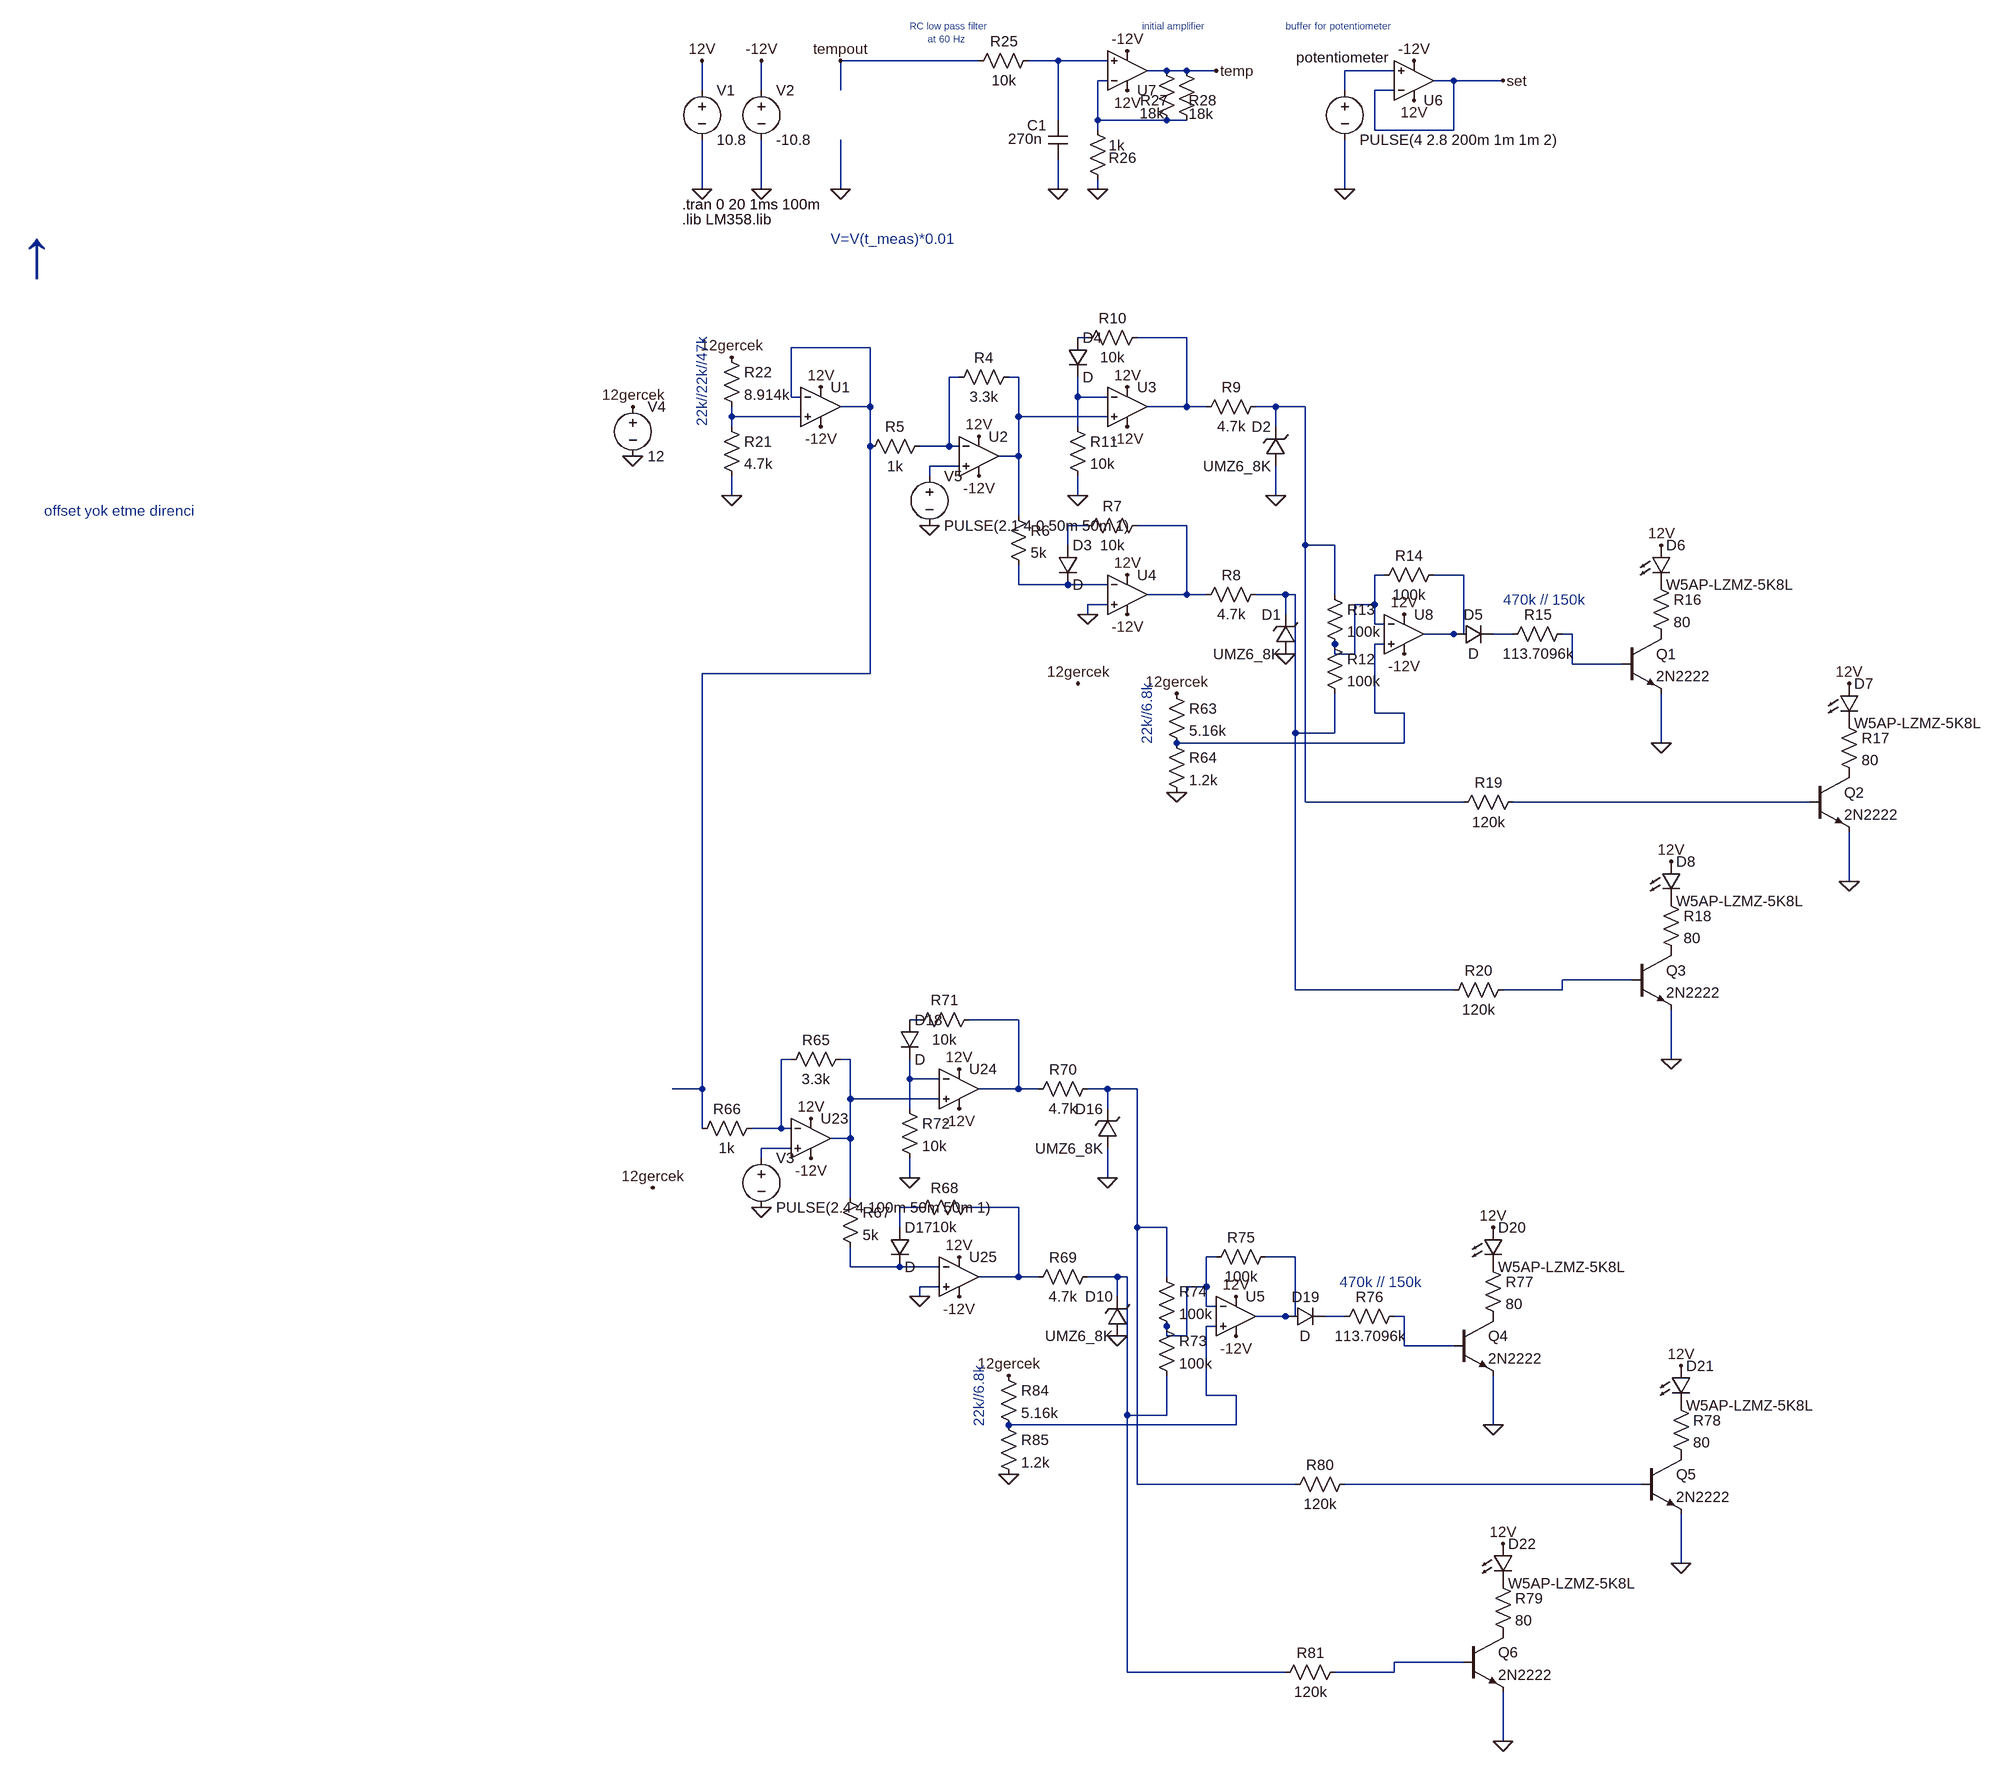
[diagram p0: schematic TRANSFORMERS-ASSEMBLE-7update.asc]
TRANSFORMERS-ASSEMBLE-7update.asc, the LTspice schematic file:
Version 4
SHEET 1 5384 2724
WIRE -912 -16 -1136 -16
WIRE -784 -16 -832 -16
WIRE -704 -16 -784 -16
WIRE -608 0 -640 0
WIRE -576 0 -608 0
WIRE -528 0 -576 0
WIRE -240 0 -320 0
WIRE -704 16 -720 16
WIRE -144 16 -176 16
WIRE -64 16 -144 16
WIRE -1360 32 -1360 -16
WIRE -1264 32 -1264 -16
WIRE -1136 32 -1136 -16
WIRE -320 32 -320 0
WIRE -240 32 -272 32
WIRE -784 80 -784 -16
WIRE -720 80 -720 16
WIRE -608 80 -720 80
WIRE -576 80 -608 80
WIRE -720 96 -720 80
WIRE -272 96 -272 32
WIRE -144 96 -144 16
WIRE -144 96 -272 96
WIRE -1360 192 -1360 112
WIRE -1264 192 -1264 112
WIRE -1136 192 -1136 112
WIRE -784 192 -784 144
WIRE -720 192 -720 176
WIRE -320 192 -320 112
WIRE -736 432 -752 432
WIRE -576 432 -656 432
WIRE -1088 448 -1216 448
WIRE -944 496 -960 496
WIRE -848 496 -864 496
WIRE -1216 528 -1216 448
WIRE -1200 528 -1216 528
WIRE -752 528 -752 496
WIRE -704 528 -752 528
WIRE -1088 544 -1088 448
WIRE -1088 544 -1136 544
WIRE -576 544 -576 432
WIRE -576 544 -640 544
WIRE -544 544 -576 544
WIRE -432 544 -464 544
WIRE -384 544 -432 544
WIRE -1312 560 -1312 544
WIRE -1200 560 -1312 560
WIRE -848 560 -848 496
WIRE -704 560 -848 560
WIRE -1312 576 -1312 560
WIRE -752 576 -752 528
WIRE -432 576 -432 544
WIRE -1088 608 -1088 544
WIRE -960 608 -960 496
WIRE -960 608 -1008 608
WIRE -944 608 -960 608
WIRE -848 624 -848 560
WIRE -848 624 -880 624
WIRE -944 640 -992 640
WIRE -992 656 -992 640
WIRE -1312 688 -1312 656
WIRE -752 688 -752 656
WIRE -432 688 -432 640
WIRE -848 720 -848 624
WIRE -736 736 -768 736
WIRE -576 736 -656 736
WIRE -768 768 -768 736
WIRE -384 768 -384 544
WIRE -336 768 -384 768
WIRE -256 816 -272 816
WIRE -128 816 -176 816
WIRE -848 832 -848 800
WIRE -768 832 -848 832
WIRE -704 832 -768 832
WIRE -576 848 -576 736
WIRE -576 848 -640 848
WIRE -544 848 -576 848
WIRE -416 848 -464 848
WIRE -400 848 -416 848
WIRE -336 848 -336 768
WIRE -704 864 -736 864
WIRE -272 864 -272 816
WIRE -272 864 -304 864
WIRE -736 880 -736 864
WIRE -416 880 -416 848
WIRE -272 896 -272 864
WIRE -256 896 -272 896
WIRE -144 912 -192 912
WIRE -128 912 -128 816
WIRE -128 912 -144 912
WIRE -48 912 -80 912
WIRE 48 912 32 912
WIRE -256 928 -272 928
WIRE -336 944 -336 928
WIRE -304 944 -304 864
WIRE -304 944 -336 944
WIRE 48 960 48 912
WIRE 128 960 48 960
WIRE -1088 976 -1088 608
WIRE -1088 976 -1360 976
WIRE -272 1040 -272 928
WIRE -224 1040 -272 1040
WIRE -400 1072 -400 848
WIRE -336 1072 -336 1008
WIRE -336 1072 -400 1072
WIRE -224 1088 -224 1040
WIRE -224 1088 -592 1088
WIRE 192 1088 192 1008
WIRE -384 1184 -384 768
WIRE -128 1184 -384 1184
WIRE 432 1184 -48 1184
WIRE 496 1312 496 1232
WIRE 144 1472 32 1472
WIRE -400 1488 -400 1072
WIRE -144 1488 -400 1488
WIRE 32 1488 32 1472
WIRE 32 1488 -64 1488
WIRE -1008 1536 -1024 1536
WIRE -848 1536 -928 1536
WIRE -1216 1600 -1232 1600
WIRE -1120 1600 -1136 1600
WIRE 208 1600 208 1520
WIRE -1024 1632 -1024 1600
WIRE -976 1632 -1024 1632
WIRE -1360 1648 -1360 976
WIRE -1360 1648 -1408 1648
WIRE -848 1648 -848 1536
WIRE -848 1648 -912 1648
WIRE -816 1648 -848 1648
WIRE -704 1648 -736 1648
WIRE -656 1648 -704 1648
WIRE -1120 1664 -1120 1600
WIRE -976 1664 -1120 1664
WIRE -1024 1680 -1024 1632
WIRE -704 1680 -704 1648
WIRE -1360 1712 -1360 1648
WIRE -1232 1712 -1232 1600
WIRE -1232 1712 -1280 1712
WIRE -1216 1712 -1232 1712
WIRE -1120 1728 -1120 1664
WIRE -1120 1728 -1152 1728
WIRE -1216 1744 -1264 1744
WIRE -1264 1760 -1264 1744
WIRE -1024 1792 -1024 1760
WIRE -704 1792 -704 1744
WIRE -1120 1824 -1120 1728
WIRE -1008 1840 -1040 1840
WIRE -848 1840 -928 1840
WIRE -1040 1872 -1040 1840
WIRE -656 1872 -656 1648
WIRE -608 1872 -656 1872
WIRE -528 1920 -544 1920
WIRE -400 1920 -448 1920
WIRE -1120 1936 -1120 1904
WIRE -1040 1936 -1120 1936
WIRE -976 1936 -1040 1936
WIRE -848 1952 -848 1840
WIRE -848 1952 -912 1952
WIRE -816 1952 -848 1952
WIRE -688 1952 -736 1952
WIRE -672 1952 -688 1952
WIRE -608 1952 -608 1872
WIRE -976 1968 -1008 1968
WIRE -544 1968 -544 1920
WIRE -544 1968 -576 1968
WIRE -1008 1984 -1008 1968
WIRE -688 1984 -688 1952
WIRE -544 2000 -544 1968
WIRE -528 2000 -544 2000
WIRE -416 2016 -464 2016
WIRE -400 2016 -400 1920
WIRE -400 2016 -416 2016
WIRE -320 2016 -352 2016
WIRE -224 2016 -240 2016
WIRE -528 2032 -544 2032
WIRE -608 2048 -608 2032
WIRE -576 2048 -576 1968
WIRE -576 2048 -608 2048
WIRE -224 2064 -224 2016
WIRE -144 2064 -224 2064
WIRE -544 2144 -544 2032
WIRE -496 2144 -544 2144
WIRE -672 2176 -672 1952
WIRE -608 2176 -608 2112
WIRE -608 2176 -672 2176
WIRE -496 2192 -496 2144
WIRE -496 2192 -864 2192
WIRE -80 2192 -80 2112
WIRE -656 2288 -656 1872
WIRE -400 2288 -656 2288
WIRE 160 2288 -320 2288
WIRE 224 2416 224 2336
WIRE -128 2576 -240 2576
WIRE -672 2592 -672 2176
WIRE -416 2592 -672 2592
WIRE -240 2592 -240 2576
WIRE -240 2592 -336 2592
WIRE -64 2704 -64 2624
FLAG -1360 192 0
FLAG -1360 -16 12V
FLAG -1264 192 0
FLAG -1264 -16 -12V
FLAG -1136 192 0
FLAG -672 -32 -12V
FLAG -672 32 12V
FLAG -784 192 0
FLAG -720 192 0
FLAG -528 0 temp
FLAG -320 192 0
FLAG -208 -16 -12V
FLAG -208 48 12V
FLAG -64 16 set
FLAG -912 656 -12V
FLAG -912 592 12V
FLAG -1312 688 0
FLAG -736 880 0
FLAG -672 880 -12V
FLAG -672 816 12V
FLAG -416 944 0
FLAG -432 688 0
FLAG -672 576 -12V
FLAG -672 512 12V
FLAG -752 688 0
FLAG -224 944 -12V
FLAG -224 880 12V
FLAG 192 1088 0
FLAG 192 768 12V
FLAG 496 1312 0
FLAG 496 992 12V
FLAG 208 1600 0
FLAG 208 1280 12V
FLAG -1168 576 -12V
FLAG -1168 512 12V
FLAG -1136 -16 tempout
FLAG -992 736 0
FLAG -592 1168 0
FLAG -1184 1760 -12V
FLAG -1184 1696 12V
FLAG -1008 1984 0
FLAG -944 1984 -12V
FLAG -944 1920 12V
FLAG -688 2048 0
FLAG -704 1792 0
FLAG -944 1680 -12V
FLAG -944 1616 12V
FLAG -1024 1792 0
FLAG -496 2048 -12V
FLAG -496 1984 12V
FLAG -80 2192 0
FLAG -80 1872 12V
FLAG 224 2416 0
FLAG 224 2096 12V
FLAG -64 2704 0
FLAG -64 2384 12V
FLAG -864 2272 0
FLAG -1264 1840 0
FLAG -1472 624 0
FLAG -1472 544 12gercek
FLAG -1312 464 12gercek
FLAG -752 992 12gercek
FLAG -592 1008 12gercek
FLAG -1440 1808 12gercek
FLAG -864 2112 12gercek
SYMBOL voltage -1360 16 R0
WINDOW 123 0 0 Left 0
WINDOW 39 0 0 Left 0
SYMATTR InstName V1
SYMATTR Value 10.8
SYMBOL voltage -1264 16 R0
WINDOW 123 0 0 Left 0
WINDOW 39 0 0 Left 0
SYMATTR InstName V2
SYMATTR Value -10.8
SYMBOL res -816 -32 R90
WINDOW 0 0 56 VBottom 2
WINDOW 3 32 56 VTop 2
SYMATTR InstName R25
SYMATTR Value 10k
SYMBOL cap -800 80 R0
WINDOW 0 -34 8 Left 2
WINDOW 3 -65 30 Left 2
SYMATTR InstName C1
SYMATTR Value 270n
SYMBOL res -736 80 R0
WINDOW 0 34 61 Left 2
WINDOW 3 34 41 Left 2
SYMATTR InstName R26
SYMATTR Value 1k
SYMBOL res -624 -16 R0
WINDOW 0 -27 64 Left 2
WINDOW 3 -28 85 Left 2
SYMATTR InstName R27
SYMATTR Value 18k
SYMBOL res -592 -16 R0
WINDOW 0 19 64 Left 2
WINDOW 3 19 86 Left 2
SYMATTR InstName R28
SYMATTR Value 18k
SYMBOL voltage -320 16 R0
WINDOW 0 -79 -38 Left 2
WINDOW 123 0 0 Left 0
WINDOW 39 0 0 Left 0
SYMATTR InstName potentiometer
SYMATTR Value PULSE(4 2.8 200m 1m 1m 2)
SYMBOL res -848 480 R90
WINDOW 0 0 56 VBottom 2
WINDOW 3 32 56 VTop 2
SYMATTR InstName R4
SYMATTR Value 3.3k
SYMBOL res -992 592 R90
WINDOW 0 0 56 VBottom 2
WINDOW 3 32 56 VTop 2
SYMATTR InstName R5
SYMATTR Value 1k
SYMBOL res -864 704 R0
SYMATTR InstName R6
SYMATTR Value 5k
SYMBOL res -640 720 R90
WINDOW 0 0 56 VBottom 2
WINDOW 3 32 56 VTop 2
SYMATTR InstName R7
SYMATTR Value 10k
SYMBOL zener -400 944 R180
WINDOW 0 24 64 Left 2
WINDOW 3 24 0 Left 2
SYMATTR InstName D1
SYMATTR Value UMZ6_8K
SYMBOL res -448 832 R90
WINDOW 0 0 56 VBottom 2
WINDOW 3 32 56 VTop 2
SYMATTR InstName R8
SYMATTR Value 4.7k
SYMBOL zener -416 640 R180
WINDOW 0 24 64 Left 2
WINDOW 3 24 0 Left 2
SYMATTR InstName D2
SYMATTR Value UMZ6_8K
SYMBOL res -448 528 R90
WINDOW 0 0 56 VBottom 2
WINDOW 3 32 56 VTop 2
SYMATTR InstName R9
SYMATTR Value 4.7k
SYMBOL res -640 416 R90
WINDOW 0 0 56 VBottom 2
WINDOW 3 32 56 VTop 2
SYMATTR InstName R10
SYMATTR Value 10k
SYMBOL res -768 560 R0
SYMATTR InstName R11
SYMATTR Value 10k
SYMBOL diode -784 768 R0
SYMATTR InstName D3
SYMBOL diode -768 432 R0
SYMATTR InstName D4
SYMBOL res -352 912 R0
SYMATTR InstName R12
SYMATTR Value 100k
SYMBOL res -352 832 R0
SYMATTR InstName R13
SYMATTR Value 100k
SYMBOL res -160 800 R90
WINDOW 0 0 56 VBottom 2
WINDOW 3 32 56 VTop 2
SYMATTR InstName R14
SYMATTR Value 100k
SYMBOL diode -144 928 R270
WINDOW 0 32 32 VTop 2
WINDOW 3 0 32 VBottom 2
SYMATTR InstName D5
SYMBOL npn 128 912 R0
SYMATTR InstName Q1
SYMATTR Value 2N2222
SYMBOL res 48 896 R90
WINDOW 0 0 56 VBottom 2
WINDOW 3 32 56 VTop 2
SYMATTR InstName R15
SYMATTR Value 113.7096k
SYMBOL LED 176 768 R0
SYMATTR InstName D6
SYMATTR Value W5AP-LZMZ-5K8L
SYMATTR Description Diode
SYMATTR Type diode
SYMBOL res 176 816 R0
SYMATTR InstName R16
SYMATTR Value 80
SYMBOL npn 432 1136 R0
SYMATTR InstName Q2
SYMATTR Value 2N2222
SYMBOL LED 480 992 R0
SYMATTR InstName D7
SYMATTR Value W5AP-LZMZ-5K8L
SYMATTR Description Diode
SYMATTR Type diode
SYMBOL res 480 1040 R0
SYMATTR InstName R17
SYMATTR Value 80
SYMBOL npn 144 1424 R0
SYMATTR InstName Q3
SYMATTR Value 2N2222
SYMBOL LED 192 1280 R0
SYMATTR InstName D8
SYMATTR Value W5AP-LZMZ-5K8L
SYMATTR Description Diode
SYMATTR Type diode
SYMBOL res 192 1328 R0
SYMATTR InstName R18
SYMATTR Value 80
SYMBOL res -32 1168 R90
WINDOW 0 0 56 VBottom 2
WINDOW 3 32 56 VTop 2
SYMATTR InstName R19
SYMATTR Value 120k
SYMBOL res -48 1472 R90
WINDOW 0 0 56 VBottom 2
WINDOW 3 32 56 VTop 2
SYMATTR InstName R20
SYMATTR Value 120k
SYMBOL res -1328 560 R0
SYMATTR InstName R21
SYMATTR Value 4.7k
SYMBOL res -1328 448 R0
SYMATTR InstName R22
SYMATTR Value 8.914k
SYMBOL Opamps\\UniversalOpamp2 -1168 544 R0
SYMATTR InstName U1
SYMBOL Opamps\\UniversalOpamp2 -912 624 R0
SYMATTR InstName U2
SYMBOL Opamps\\UniversalOpamp2 -672 544 R0
SYMATTR InstName U3
SYMBOL Opamps\\UniversalOpamp2 -672 848 R0
SYMATTR InstName U4
SYMBOL Opamps\\UniversalOpamp2 -208 16 M180
SYMATTR InstName U6
SYMBOL Opamps\\UniversalOpamp2 -672 0 M180
SYMATTR InstName U7
SYMBOL voltage -992 640 R0
WINDOW 123 0 0 Left 0
WINDOW 39 0 0 Left 0
SYMATTR InstName V5
SYMATTR Value PULSE(2.1 4 0 50m 50m 1)
SYMBOL res -608 992 R0
SYMATTR InstName R63
SYMATTR Value 5.16k
SYMBOL res -608 1072 R0
SYMATTR InstName R64
SYMATTR Value 1.2k
SYMBOL res -1120 1584 R90
WINDOW 0 0 56 VBottom 2
WINDOW 3 32 56 VTop 2
SYMATTR InstName R65
SYMATTR Value 3.3k
SYMBOL res -1264 1696 R90
WINDOW 0 0 56 VBottom 2
WINDOW 3 32 56 VTop 2
SYMATTR InstName R66
SYMATTR Value 1k
SYMBOL res -1136 1808 R0
SYMATTR InstName R67
SYMATTR Value 5k
SYMBOL res -912 1824 R90
WINDOW 0 0 56 VBottom 2
WINDOW 3 32 56 VTop 2
SYMATTR InstName R68
SYMATTR Value 10k
SYMBOL zener -672 2048 R180
WINDOW 0 24 64 Left 2
WINDOW 3 24 0 Left 2
SYMATTR InstName D10
SYMATTR Value UMZ6_8K
SYMBOL res -720 1936 R90
WINDOW 0 0 56 VBottom 2
WINDOW 3 32 56 VTop 2
SYMATTR InstName R69
SYMATTR Value 4.7k
SYMBOL zener -688 1744 R180
WINDOW 0 24 64 Left 2
WINDOW 3 24 0 Left 2
SYMATTR InstName D16
SYMATTR Value UMZ6_8K
SYMBOL res -720 1632 R90
WINDOW 0 0 56 VBottom 2
WINDOW 3 32 56 VTop 2
SYMATTR InstName R70
SYMATTR Value 4.7k
SYMBOL res -912 1520 R90
WINDOW 0 0 56 VBottom 2
WINDOW 3 32 56 VTop 2
SYMATTR InstName R71
SYMATTR Value 10k
SYMBOL res -1040 1664 R0
SYMATTR InstName R72
SYMATTR Value 10k
SYMBOL diode -1056 1872 R0
SYMATTR InstName D17
SYMBOL diode -1040 1536 R0
SYMATTR InstName D18
SYMBOL res -624 2016 R0
SYMATTR InstName R73
SYMATTR Value 100k
SYMBOL res -624 1936 R0
SYMATTR InstName R74
SYMATTR Value 100k
SYMBOL res -432 1904 R90
WINDOW 0 0 56 VBottom 2
WINDOW 3 32 56 VTop 2
SYMATTR InstName R75
SYMATTR Value 100k
SYMBOL diode -416 2032 R270
WINDOW 0 32 32 VTop 2
WINDOW 3 0 32 VBottom 2
SYMATTR InstName D19
SYMBOL npn -144 2016 R0
SYMATTR InstName Q4
SYMATTR Value 2N2222
SYMBOL res -224 2000 R90
WINDOW 0 0 56 VBottom 2
WINDOW 3 32 56 VTop 2
SYMATTR InstName R76
SYMATTR Value 113.7096k
SYMBOL LED -96 1872 R0
SYMATTR InstName D20
SYMATTR Value W5AP-LZMZ-5K8L
SYMATTR Description Diode
SYMATTR Type diode
SYMBOL res -96 1920 R0
SYMATTR InstName R77
SYMATTR Value 80
SYMBOL npn 160 2240 R0
SYMATTR InstName Q5
SYMATTR Value 2N2222
SYMBOL LED 208 2096 R0
SYMATTR InstName D21
SYMATTR Value W5AP-LZMZ-5K8L
SYMATTR Description Diode
SYMATTR Type diode
SYMBOL res 208 2144 R0
SYMATTR InstName R78
SYMATTR Value 80
SYMBOL npn -128 2528 R0
SYMATTR InstName Q6
SYMATTR Value 2N2222
SYMBOL LED -80 2384 R0
SYMATTR InstName D22
SYMATTR Value W5AP-LZMZ-5K8L
SYMATTR Description Diode
SYMATTR Type diode
SYMBOL res -80 2432 R0
SYMATTR InstName R79
SYMATTR Value 80
SYMBOL res -304 2272 R90
WINDOW 0 0 56 VBottom 2
WINDOW 3 32 56 VTop 2
SYMATTR InstName R80
SYMATTR Value 120k
SYMBOL res -320 2576 R90
WINDOW 0 0 56 VBottom 2
WINDOW 3 32 56 VTop 2
SYMATTR InstName R81
SYMATTR Value 120k
SYMBOL Opamps\\UniversalOpamp2 -1184 1728 R0
SYMATTR InstName U23
SYMBOL Opamps\\UniversalOpamp2 -944 1648 R0
SYMATTR InstName U24
SYMBOL Opamps\\UniversalOpamp2 -944 1952 R0
SYMATTR InstName U25
SYMBOL res -880 2096 R0
SYMATTR InstName R84
SYMATTR Value 5.16k
SYMBOL res -880 2176 R0
SYMATTR InstName R85
SYMATTR Value 1.2k
SYMBOL voltage -1264 1744 R0
WINDOW 123 0 0 Left 0
WINDOW 39 0 0 Left 0
SYMATTR InstName V3
SYMATTR Value PULSE(2.4 4 100m 50m 50m 1)
SYMBOL Opamps\\UniversalOpamp2 -496 2016 R0
SYMATTR InstName U5
SYMBOL Opamps\\UniversalOpamp2 -224 912 R0
SYMATTR InstName U8
SYMBOL voltage -1472 528 R0
WINDOW 123 0 0 Left 0
WINDOW 39 0 0 Left 0
SYMATTR InstName V4
SYMATTR Value 12
TEXT -1024 -72 Left 1 ;RC low pass filter\n      at 60 Hz
TEXT -648 -72 Left 1 ;initial amplifier
TEXT -416 -72 Left 1 ;buffer for potentiometer
TEXT -1392 216 Left 2 !.tran 0 20 1ms 100m
TEXT -1392 240 Left 2 !.lib LM358.lib
TEXT -2424 712 Left 2 ;offset yok etme direnci
TEXT -2464 296 Left 7 ;↑
TEXT -1152 272 Left 2 ;V=V(t_meas)*0.01
TEXT -1360 432 VRight 2 ;22k//22k//47k
TEXT -640 992 VRight 2 ;22k//6.8k
TEXT -912 2096 VRight 2 ;22k//6.8k
TEXT -64 856 Left 2 ;470k // 150k
TEXT -328 1960 Left 2 ;470k // 150k

The netlist it stands for:
* TRANSFORMERS-ASSEMBLE-7update.asc
V1 12V 0 10.8
V2 -12V 0 -10.8
R25 N001 tempout 10k
C1 N001 0 270n
R26 N003 0 1k
R27 temp N003 18k
R28 temp N003 18k
V§potentiometer N002 0 PULSE(4 2.8 200m 1m 1m 2)
R4 N008 N007 3.3k
R5 N007 N006 1k
R6 N008 N017 5k
R7 N014 N013 10k
D1 0 N018 UMZ6_8K
R8 N018 N014 4.7k
D2 0 N010 UMZ6_8K
R9 N010 N005 4.7k
R10 N005 N004 10k
R11 N009 0 10k
D3 N013 N017 D
D4 N004 N009 D
R12 N015 N018 100k
R13 N010 N015 100k
R14 N016 N015 100k
D5 N016 N019 D
Q1 P001 N020 0 0 2N2222
R15 N020 N019 113.7096k
D6 12V P002 W5AP-LZMZ-5K8L
R16 P002 P001 80
Q2 P003 N022 0 0 2N2222
D7 12V P004 W5AP-LZMZ-5K8L
R17 P004 P003 80
Q3 P005 N023 0 0 2N2222
D8 12V P006 W5AP-LZMZ-5K8L
R18 P006 P005 80
R19 N022 N010 120k
R20 N023 N018 120k
R21 N011 0 4.7k
R22 12gercek N011 8.914k
XU1 N011 N006 12V -12V N006 level.2 Avol=1Meg GBW=10Meg Slew=10Meg ilimit=25m rail=0 Vos=0 phimargin=45 en=0 enk=0 in=0 ink=0 Rin=500Meg  ; pins IN+ IN- V+ V- OUT
XU2 N012 N007 12V -12V N008 level.2 Avol=1Meg GBW=10Meg Slew=10Meg ilimit=25m rail=0 Vos=0 phimargin=45 en=0 enk=0 in=0 ink=0 Rin=500Meg  ; pins IN+ IN- V+ V- OUT
XU3 N008 N009 12V -12V N005 level.2 Avol=1Meg GBW=10Meg Slew=10Meg ilimit=25m rail=0 Vos=0 phimargin=45 en=0 enk=0 in=0 ink=0 Rin=500Meg  ; pins IN+ IN- V+ V- OUT
XU4 0 N017 12V -12V N014 level.2 Avol=1Meg GBW=10Meg Slew=10Meg ilimit=25m rail=0 Vos=0 phimargin=45 en=0 enk=0 in=0 ink=0 Rin=500Meg  ; pins IN+ IN- V+ V- OUT
XU6 N002 set 12V -12V set level.2 Avol=1Meg GBW=10Meg Slew=10Meg ilimit=25m rail=0 Vos=0 phimargin=45 en=0 enk=0 in=0 ink=0 Rin=500Meg  ; pins IN+ IN- V+ V- OUT
XU7 N001 N003 12V -12V temp level.2 Avol=1Meg GBW=10Meg Slew=10Meg ilimit=25m rail=0 Vos=0 phimargin=45 en=0 enk=0 in=0 ink=0 Rin=500Meg  ; pins IN+ IN- V+ V- OUT
V5 N012 0 PULSE(2.1 4 0 50m 50m 1)
R63 12gercek N021 5.16k
R64 N021 0 1.2k
R65 N027 N026 3.3k
R66 N026 N006 1k
R67 N027 N035 5k
R68 N032 N031 10k
D10 0 N036 UMZ6_8K
R69 N036 N032 4.7k
D16 0 N029 UMZ6_8K
R70 N029 N025 4.7k
R71 N025 N024 10k
R72 N028 0 10k
D17 N031 N035 D
D18 N024 N028 D
R73 N033 N036 100k
R74 N029 N033 100k
R75 N034 N033 100k
D19 N034 N037 D
Q4 P007 N038 0 0 2N2222
R76 N038 N037 113.7096k
D20 12V P008 W5AP-LZMZ-5K8L
R77 P008 P007 80
Q5 P009 N040 0 0 2N2222
D21 12V P010 W5AP-LZMZ-5K8L
R78 P010 P009 80
Q6 P011 N041 0 0 2N2222
D22 12V P012 W5AP-LZMZ-5K8L
R79 P012 P011 80
R80 N040 N029 120k
R81 N041 N036 120k
XU23 N030 N026 12V -12V N027 level.2 Avol=1Meg GBW=10Meg Slew=10Meg ilimit=25m rail=0 Vos=0 phimargin=45 en=0 enk=0 in=0 ink=0 Rin=500Meg  ; pins IN+ IN- V+ V- OUT
XU24 N027 N028 12V -12V N025 level.2 Avol=1Meg GBW=10Meg Slew=10Meg ilimit=25m rail=0 Vos=0 phimargin=45 en=0 enk=0 in=0 ink=0 Rin=500Meg  ; pins IN+ IN- V+ V- OUT
XU25 0 N035 12V -12V N032 level.2 Avol=1Meg GBW=10Meg Slew=10Meg ilimit=25m rail=0 Vos=0 phimargin=45 en=0 enk=0 in=0 ink=0 Rin=500Meg  ; pins IN+ IN- V+ V- OUT
R84 12gercek N039 5.16k
R85 N039 0 1.2k
V3 N030 0 PULSE(2.4 4 100m 50m 50m 1)
XU5 N039 N033 12V -12V N034 level.2 Avol=1Meg GBW=10Meg Slew=10Meg ilimit=25m rail=0 Vos=0 phimargin=45 en=0 enk=0 in=0 ink=0 Rin=500Meg  ; pins IN+ IN- V+ V- OUT
XU8 N021 N015 12V -12V N016 level.2 Avol=1Meg GBW=10Meg Slew=10Meg ilimit=25m rail=0 Vos=0 phimargin=45 en=0 enk=0 in=0 ink=0 Rin=500Meg  ; pins IN+ IN- V+ V- OUT
V4 12gercek 0 12
.model D D
.lib standard.dio
.model NPN NPN
.model PNP PNP
.lib standard.bjt
* RC low pass filter
*       at 60 Hz
* initial amplifier
* buffer for potentiometer
.tran 0 20 1ms 100m
.lib LM358.lib
* offset yok etme direnci
* ↑
* V=V(t_meas)*0.01
* 22k//22k//47k
* 22k//6.8k
* 22k//6.8k
* 470k // 150k
* 470k // 150k
.lib UniversalOpamps2.sub
.backanno
.end